# Altium schematic sheet MCPS Power All 030521.SchDoc
size A4
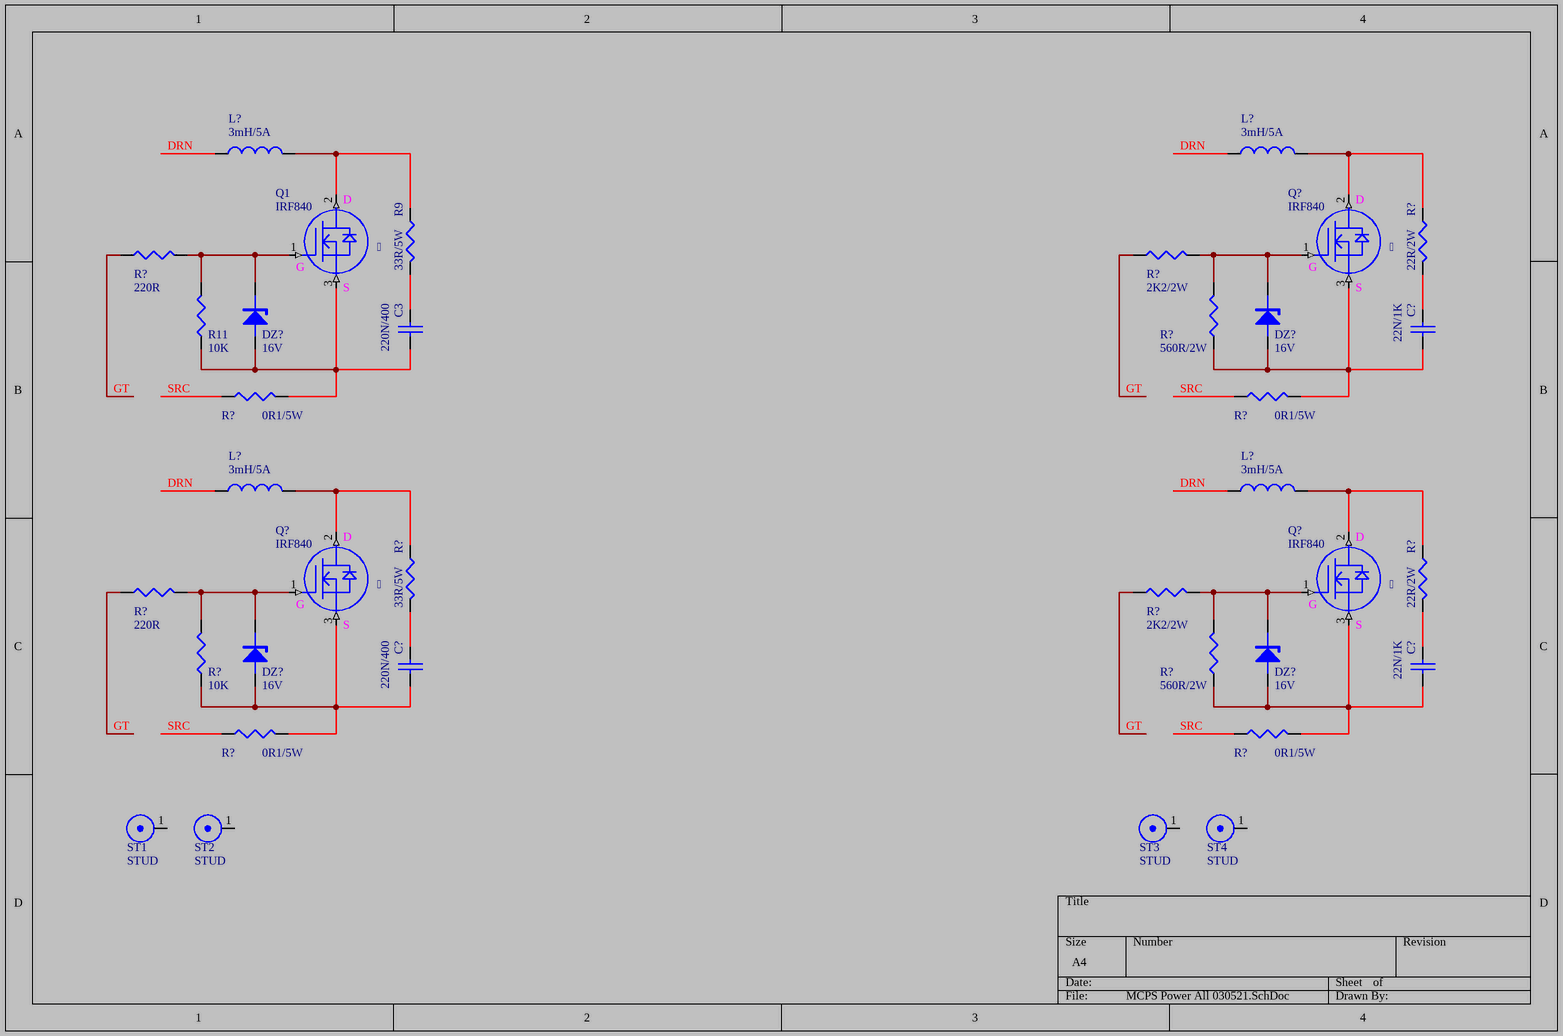
[diagram p0: MCPS Power All 030521.SchDoc]

## Parts
(Parts that share a designator on the sheet are numbered #1, #2 ... from top to bottom, then left to right.)
C3  220N/400  [C2P]
C?#1  22N/1K  [C2P]
C?#2  220N/400  [C2P]
C?#3  22N/1K  [C2P]
DZ?#1  16V  [D5P]
DZ?#2  16V  [D5P]
DZ?#3  16V  [D5P]
DZ?#4  16V  [D5P]
L?#1  3mH/5A  [Inductor3916]
L?#2  3mH/5A  [Inductor3916]
L?#3  3mH/5A  [Inductor3916]
L?#4  3mH/5A  [Inductor3916]
Q1    [TO247-MOSPIN]
Q?#1    [TO247-MOSPIN]
Q?#2    [TO247-MOSPIN]
Q?#3    [TO247-MOSPIN]
R9  33R/5W  [W1]
R11  10K  [W1/4]
R?#1  22R/2W  [W1]
R?#2  220R  [W1]
R?#3  2K2/2W  [W1]
R?#4  560R/2W  [W1/4]
R?#5  0R1/5W  [W1]
R?#6  0R1/5W  [W1]
R?#7  33R/5W  [W1]
R?#8  22R/2W  [W1]
R?#9  220R  [W1]
R?#10  2K2/2W  [W1]
R?#11  10K  [W1/4]
R?#12  560R/2W  [W1/4]
R?#13  0R1/5W  [W1]
R?#14  0R1/5W  [W1]
ST1  STUD  [CORNER]
ST2  STUD  [CORNER]
ST3  STUD  [CORNER]
ST4  STUD  [CORNER]

## Nets
DRN: L?#1.1 L?#2.1 L?#3.1 L?#4.1
GT: R?#2.1 R?#3.1 R?#9.1 R?#10.1
SRC: R?#5.1 R?#6.1 R?#13.1 R?#14.1
NetC3_1: C3.1 R9.2
NetC3_2: C3.2 DZ?#1.1(A) Q1.3(S) R11.1 R?#5.2
NetC?#1_1: C?#1.1 R?#1.2
NetC?#1_2: C?#1.2 DZ?#2.1(A) Q?#1.3(S) R?#4.1 R?#6.2
NetC?#2_1: C?#2.1 R?#7.2
NetC?#2_2: C?#2.2 DZ?#3.1(A) Q?#2.3(S) R?#11.1 R?#13.2
NetC?#3_1: C?#3.1 R?#8.2
NetC?#3_2: C?#3.2 DZ?#4.1(A) Q?#3.3(S) R?#12.1 R?#14.2
NetDZ?#1_2: DZ?#1.2(K) Q1.1(G) R11.2 R?#2.2
NetDZ?#2_2: DZ?#2.2(K) Q?#1.1(G) R?#3.2 R?#4.2
NetDZ?#3_2: DZ?#3.2(K) Q?#2.1(G) R?#9.2 R?#11.2
NetDZ?#4_2: DZ?#4.2(K) Q?#3.1(G) R?#10.2 R?#12.2
NetL?#1_2: L?#1.2 Q1.2(D) R9.1
NetL?#2_2: L?#2.2 Q?#1.2(D) R?#1.1
NetL?#3_2: L?#3.2 Q?#2.2(D) R?#7.1
NetL?#4_2: L?#4.2 Q?#3.2(D) R?#8.1

Not connected (* = marked no-connect by the designer): ST1 1; ST2 1; ST3 1; ST4 1

## Notes on the sheet
- (near Q1) IRF840
- (near Q1) D
- (near Q?#1) IRF840
- (near Q?#1) D
- (near Q1) G
- (near Q1) S
- (near Q?#1) G
- (near Q?#1) S
- (near Q?#2) IRF840
- (near Q?#2) D
- (near Q?#3) IRF840
- (near Q?#3) D
- (near Q?#2) G
- (near Q?#2) S
- (near Q?#3) G
- (near Q?#3) S

## Library data of the parts
C3 C?#1-C?#3 = C
DZ?#1-DZ?#4 = DZ
L?#1-L?#4 = INDUCTOR
Q1 Q?#1-Q?#3 = MOSFET N
R9 R11 R?#1-R?#14 = R